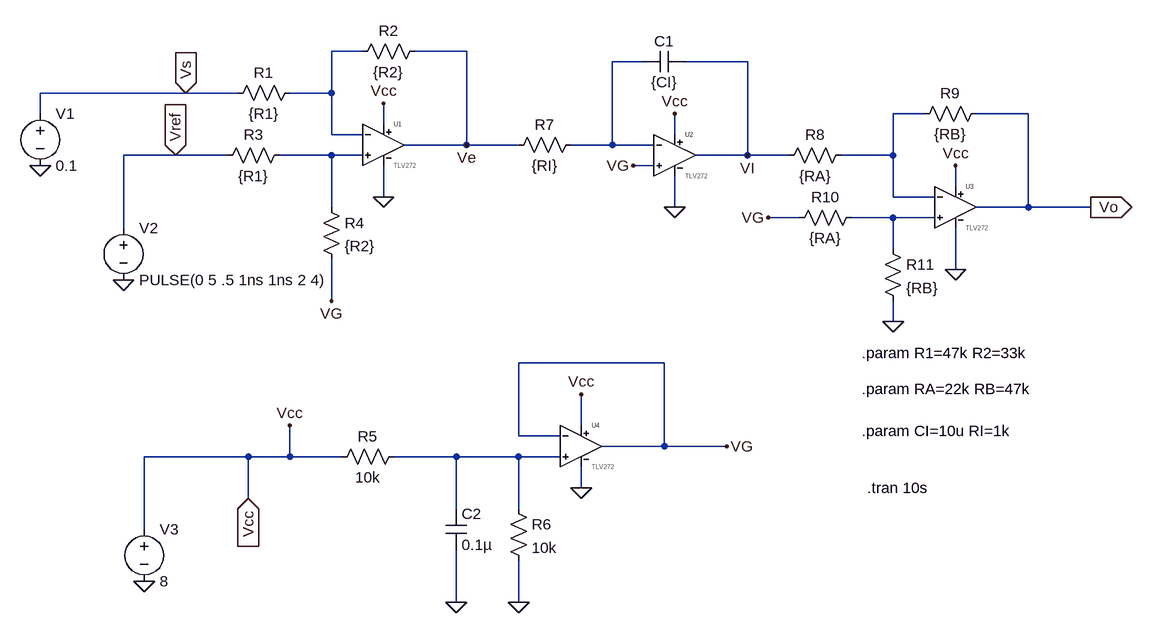
[diagram p0: schematic I-Compensator.asc]
I-Compensator.asc, the LTspice schematic file:
Version 4
SHEET 1 1524 1472
WIRE 176 48 128 48
WIRE 336 48 256 48
WIRE 608 64 560 64
WIRE 768 64 672 64
WIRE -96 112 -320 112
WIRE -16 112 -96 112
WIRE 128 112 128 48
WIRE 128 112 64 112
WIRE -320 144 -320 112
WIRE 1040 144 992 144
WIRE 1200 144 1120 144
WIRE 208 160 208 128
WIRE 128 176 128 112
WIRE 176 176 128 176
WIRE 656 176 656 144
WIRE 336 192 336 48
WIRE 336 192 240 192
WIRE 416 192 336 192
WIRE 560 192 560 64
WIRE 560 192 496 192
WIRE 624 192 560 192
WIRE -112 208 -192 208
WIRE -32 208 -112 208
WIRE 128 208 48 208
WIRE 176 208 128 208
WIRE 768 208 768 64
WIRE 768 208 688 208
WIRE 832 208 768 208
WIRE 992 208 992 144
WIRE 992 208 912 208
WIRE 624 224 592 224
WIRE 1088 256 1088 224
WIRE 208 272 208 224
WIRE 992 272 992 208
WIRE 1056 272 992 272
WIRE 128 288 128 208
WIRE 656 288 656 240
WIRE 1200 288 1200 144
WIRE 1200 288 1120 288
WIRE 1296 288 1200 288
WIRE 848 304 800 304
WIRE 992 304 928 304
WIRE 1056 304 992 304
WIRE -192 320 -192 208
WIRE 992 352 992 304
WIRE 1088 384 1088 320
WIRE 128 432 128 368
WIRE 992 464 992 432
WIRE 640 528 416 528
WIRE 512 624 512 576
WIRE 416 640 416 528
WIRE 480 640 416 640
WIRE 640 656 640 528
WIRE 640 656 544 656
WIRE 736 656 640 656
WIRE 0 672 -160 672
WIRE 64 672 64 624
WIRE 64 672 0 672
WIRE 144 672 64 672
WIRE 320 672 224 672
WIRE 416 672 320 672
WIRE 480 672 416 672
WIRE 512 720 512 688
WIRE 0 736 0 672
WIRE 320 752 320 672
WIRE 416 752 416 672
WIRE -160 784 -160 672
WIRE 320 896 320 816
WIRE 416 896 416 832
FLAG 208 128 Vcc
FLAG 208 272 0
FLAG 592 224 VG
FLAG 656 288 0
FLAG 1088 224 Vcc
FLAG 656 144 Vcc
FLAG 992 464 0
FLAG 800 304 VG
FLAG 1088 384 0
FLAG 320 896 0
FLAG 416 896 0
FLAG 736 656 VG
FLAG 512 576 Vcc
FLAG 64 624 Vcc
FLAG 512 720 0
FLAG 1296 288 Vo
IOPIN 1296 288 Out
FLAG 128 432 VG
FLAG 768 208 VI
FLAG 336 192 Ve
FLAG -112 208 Vref
IOPIN -112 208 In
FLAG -96 112 Vs
IOPIN -96 112 In
FLAG 0 736 Vcc
IOPIN 0 736 In
FLAG -160 864 0
FLAG -192 400 0
FLAG -320 224 0
SYMBOL res 80 96 R90
WINDOW 0 0 56 VBottom 2
WINDOW 3 32 56 VTop 2
SYMATTR InstName R1
SYMATTR Value {R1}
SYMBOL res 272 32 R90
WINDOW 0 0 56 VBottom 2
WINDOW 3 32 56 VTop 2
SYMATTR InstName R2
SYMATTR Value {R2}
SYMBOL TLV272 208 192 R0
SYMATTR InstName U1
SYMBOL res 512 176 R90
WINDOW 0 0 56 VBottom 2
WINDOW 3 32 56 VTop 2
SYMATTR InstName R7
SYMATTR Value {RI}
SYMBOL cap 672 48 R90
WINDOW 0 0 32 VBottom 2
WINDOW 3 32 32 VTop 2
SYMATTR InstName C1
SYMATTR Value {CI}
SYMBOL TLV272 656 208 R0
SYMATTR InstName U2
SYMBOL res 928 192 R90
WINDOW 0 0 56 VBottom 2
WINDOW 3 32 56 VTop 2
SYMATTR InstName R8
SYMATTR Value {RA}
SYMBOL res 1136 128 R90
WINDOW 0 0 56 VBottom 2
WINDOW 3 32 56 VTop 2
SYMATTR InstName R9
SYMATTR Value {RB}
SYMBOL TLV272 1088 288 R0
SYMATTR InstName U3
SYMBOL res 976 336 R0
SYMATTR InstName R11
SYMATTR Value {RB}
SYMBOL res 944 288 R90
WINDOW 0 0 56 VBottom 2
WINDOW 3 32 56 VTop 2
SYMATTR InstName R10
SYMATTR Value {RA}
SYMBOL res 240 656 R90
WINDOW 0 0 56 VBottom 2
WINDOW 3 32 56 VTop 2
SYMATTR InstName R5
SYMATTR Value 10k
SYMBOL cap 304 752 R0
SYMATTR InstName C2
SYMATTR Value 0.1µ
SYMBOL res 400 736 R0
SYMATTR InstName R6
SYMATTR Value 10k
SYMBOL TLV272 512 656 R0
SYMATTR InstName U4
SYMBOL res 64 192 R90
WINDOW 0 0 56 VBottom 2
WINDOW 3 32 56 VTop 2
SYMATTR InstName R3
SYMATTR Value {R1}
SYMBOL res 112 272 R0
SYMATTR InstName R4
SYMATTR Value {R2}
SYMBOL voltage -320 128 R0
WINDOW 123 0 0 Left 0
WINDOW 39 24 124 Left 2
SYMATTR InstName V1
SYMATTR Value 0.1
SYMBOL voltage -192 304 R0
WINDOW 123 0 0 Left 0
WINDOW 39 0 0 Left 0
SYMATTR InstName V2
SYMATTR Value PULSE(0 5 .5 1ns 1ns 2 4)
SYMBOL voltage -160 768 R0
WINDOW 123 0 0 Left 0
WINDOW 39 0 0 Left 0
SYMATTR InstName V3
SYMATTR Value 8
TEXT 944 512 Left 2 !.param R1=47k R2=33k
TEXT 944 568 Left 2 !.param RA=22k RB=47k
TEXT 944 632 Left 2 !.param CI=10u RI=1k
TEXT 952 720 Left 2 !.tran 10s

The netlist it stands for:
* I-Compensator.asc
R1 N001 Vs {R1}
R2 Ve N001 {R2}
XU1 N004 N001 Vcc 0 Ve level.2 Avol=1Meg GBW=3Meg Slew=2.4Meg ilimit=20m rail=0.1 Vos=0 phimargin=45 en=0 enk=0 in=0 ink=0 Rin=500Meg  ; pins In+ In- V+ V- OUT
R7 N002 Ve {RI}
C1 VI N002 {CI}
XU2 VG N002 Vcc 0 VI level.2 Avol=1Meg GBW=3Meg Slew=2.4Meg ilimit=20m rail=0.1 Vos=0 phimargin=45 en=0 enk=0 in=0 ink=0 Rin=500Meg  ; pins In+ In- V+ V- OUT
R8 N003 VI {RA}
R9 Vo N003 {RB}
XU3 N005 N003 Vcc 0 Vo level.2 Avol=1Meg GBW=3Meg Slew=2.4Meg ilimit=20m rail=0.1 Vos=0 phimargin=45 en=0 enk=0 in=0 ink=0 Rin=500Meg  ; pins In+ In- V+ V- OUT
R11 N005 0 {RB}
R10 N005 VG {RA}
R5 N006 Vcc 10k
C2 N006 0 0.1µ
R6 N006 0 10k
XU4 N006 VG Vcc 0 VG level.2 Avol=1Meg GBW=3Meg Slew=2.4Meg ilimit=20m rail=0.1 Vos=0 phimargin=45 en=0 enk=0 in=0 ink=0 Rin=500Meg  ; pins In+ In- V+ V- OUT
R3 N004 Vref {R1}
R4 N004 VG {R2}
V1 Vs 0 0.1
V2 Vref 0 PULSE(0 5 .5 1ns 1ns 2 4)
V3 Vcc 0 8
.param R1=47k R2=33k
.param RA=22k RB=47k
.param CI=10u RI=1k
.tran 10s
.lib UniversalOpamps2.sub
.backanno
.end